# Altium schematic sheet SignalAdapter.SchDoc
size A4; SheetNumber: 2; SheetTotal: 2
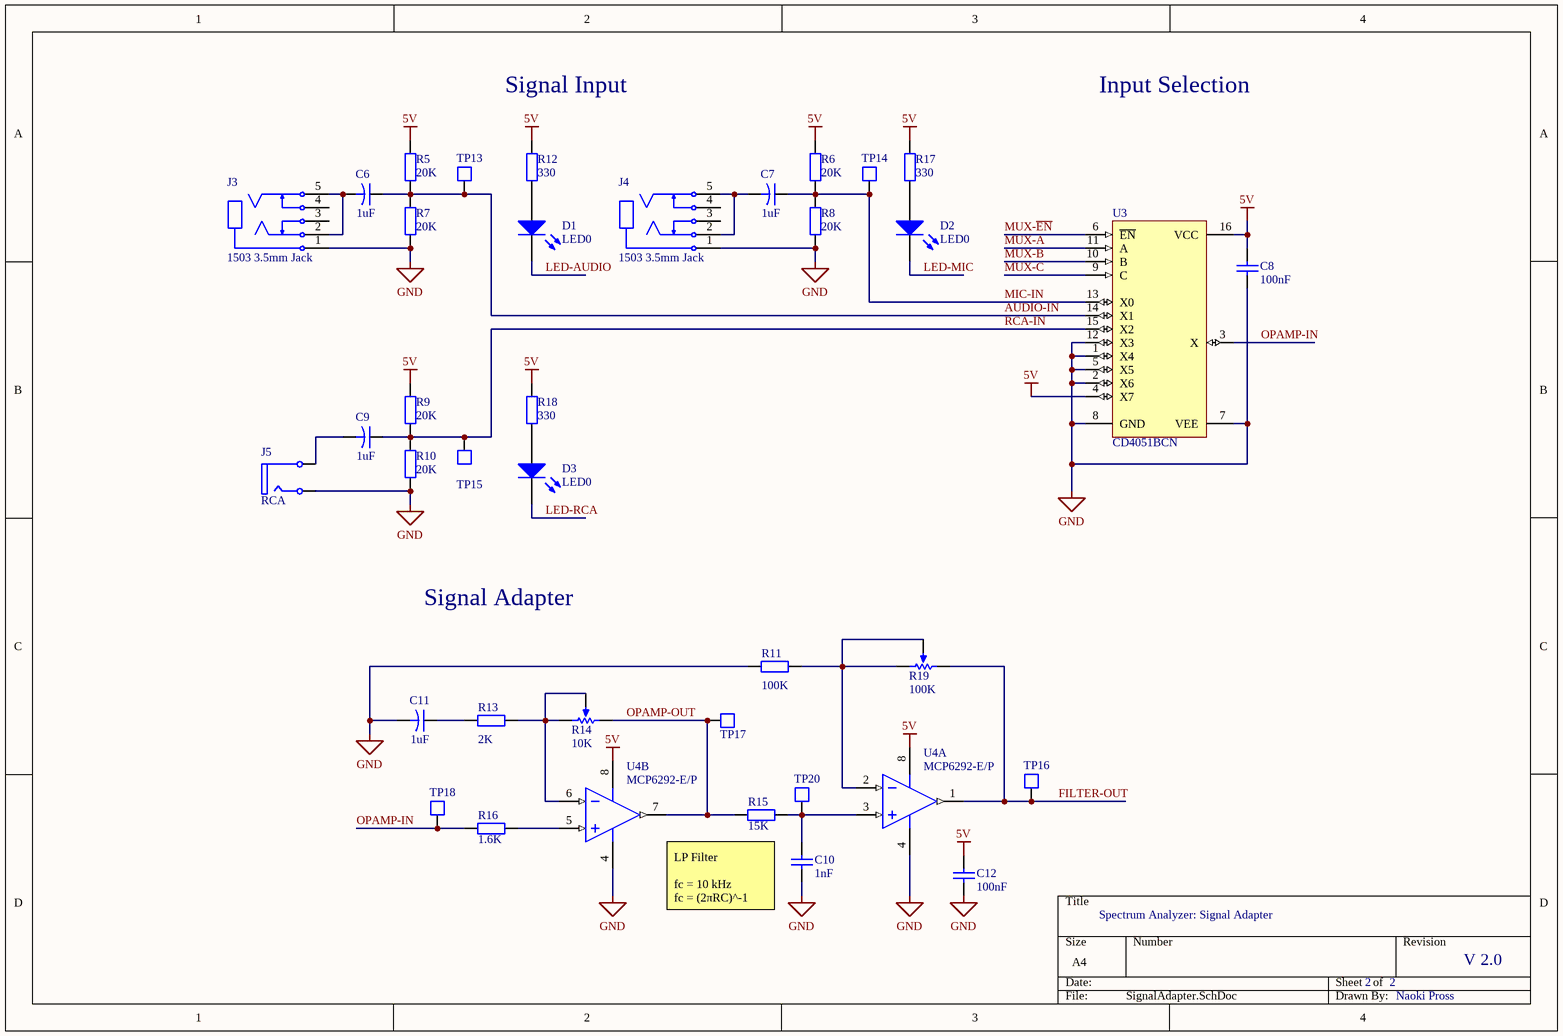
[diagram p0: SignalAdapter.SchDoc]

## Parts
C6  value 1uF  [CAPR5-4X5]  (hidden comment: Cap2)
C7  value 1uF  [CAPR5-4X5]  (hidden comment: Cap2)
C8  value 100nF  [RAD-0.1]  (hidden comment: Cap)
C9  value 1uF  [CAPR5-4X5]  (hidden comment: Cap2)
C10  value 1nF  [RAD-0.1]  (hidden comment: Cap)
C11  value 1uF  [CAPR5-4X5]  (hidden comment: Cap2)
C12  value 100nF  [RAD-0.1]  (hidden comment: Cap)
D1  LED0  [LED-0]
D2  LED0  [LED-0]
D3  LED0  [LED-0]
J3  1503 3.5mm Jack  [JIS C 6560]
J4  1503 3.5mm Jack  [JIS C 6560]
J5  RCA  [RC-5231]
R5  value 20K  [AXIAL-0.4]  (hidden comment: Res2)
R6  value 20K  [AXIAL-0.4]  (hidden comment: Res2)
R7  value 20K  [AXIAL-0.4]  (hidden comment: Res2)
R8  value 20K  [AXIAL-0.4]  (hidden comment: Res2)
R9  value 20K  [AXIAL-0.4]  (hidden comment: Res2)
R10  value 20K  [AXIAL-0.4]  (hidden comment: Res2)
R11  value 100K  [AXIAL-0.4]  (hidden comment: Res2)
R12  value 330  [AXIAL-0.4]  (hidden comment: Res2)
R13  value 2K  [AXIAL-0.4]  (hidden comment: Res2)
R14  value 10K  [VR4]  (hidden comment: RPot)
R15  value 15K  [AXIAL-0.4]  (hidden comment: Res2)
R16  value 1.6K  [AXIAL-0.4]  (hidden comment: Res2)
R17  value 330  [AXIAL-0.4]  (hidden comment: Res2)
R18  value 330  [AXIAL-0.4]  (hidden comment: Res2)
R19  value 100K  [VR4]  (hidden comment: RPot)
TP13  Test Pad  [PIN1]  (value not drawn)
TP14  Test Pad  [PIN1]  (value not drawn)
TP15  Test Pad  [PIN1]  (value not drawn)
TP16  Test Pad  [PIN1]  (value not drawn)
TP17  Test Pad  [PIN1]  (value not drawn)
TP18  Test Pad  [PIN1]  (value not drawn)
TP20  Test Pad  [PIN1]  (value not drawn)
U3  CD4051BCN  [N16E]
U4  MCP6292-E/P  [PDIP300-P8]  (parts A,B of 2)

## Nets
5V: C8.1 C12.1 R5.2 R6.2 R9.2 R12.2 R17.2 R18.2 U3.4(X7) U3.16(VCC) U4.8(VDD)
GND: C8.2 C10.1 C11.2 C12.2 J3.1 J4.1 J5.2B(Signal) R7.1 R8.1 R10.1 R11.1 U3.1(X4) U3.2(X6) U3.5(X5) U3.7(VEE) U3.8(GND) U3.12(X3) U4.4(VSS)
AUDIO-IN: C6.1 R5.1 R7.2 TP13.1 U3.14(X1)
FILTER-OUT: R19.1(TOP) TP16.1 U4.1(VOUTA)
LED-AUDIO: D1.2(K)
LED-MIC: D2.2(K)
LED-RCA: D3.2(K)
MIC-IN: C7.1 R6.1 R8.2 TP14.1 U3.13(X0)
MUX-A: U3.11(A)
MUX-B: U3.10(B)
MUX-C: U3.9(C)
MUX-~{EN}: U3.6(~{EN})
OPAMP-IN: R16.2 TP18.1 U3.3(X)
OPAMP-OUT: R14.1(TOP) R15.2 TP17.1 U4.7(VOUTB)
RCA-IN: C9.1 R9.1 R10.2 TP15.1 U3.15(X2)
NetC6_2: C6.2 J3.2 J3.5
NetC7_2: C7.2 J4.2 J4.5
NetC9_2: C9.2 J5.1A(Ground)
NetC10_2: C10.2 R15.1 TP20.1 U4.3(VINA+)
NetC11_1: C11.1 R13.1
NetD1_1: D1.1(A) R12.1
NetD2_1: D2.1(A) R17.1
NetD3_1: D3.1(A) R18.1
NetR11_2: R11.2 R19.2(BOT) R19.3(TAP) U4.2(VINA-)
NetR13_2: R13.2 R14.2(BOT) R14.3(TAP) U4.6(VINB-)
NetR16_1: R16.1 U4.5(VINB+)

Not connected (* = marked no-connect by the designer): J3 3 4; J4 3 4

## Notes on the sheet
- Signal Input
- Input Selection
- Signal Adapter
- LP Filter
  fc = 10 kHz
  fc = (2πRC)^-1
- Spectrum Analyzer: Signal Adapter
- V 2.0
- Naoki Pross

## Library data of the parts
C6 C7 C9 C11 = Cap2: Capacitor; Published: 23-Sep-2002; PackageReference: CAPR5-4X5; Publisher: Altium Limited; PackageDescription: Capacitor; 2 Leads
C8 C10 C12 = Cap: Capacitor; Published: 8-Jun-2000; LatestRevisionDate: 17-Jul-2002; LatestRevisionNote: Re-released for DXP Platform.; PackageReference: RAD-0.3; Publisher: Altium Limited; PackageDescription: Radial Cap, Thru-Hole; 2 Leads; 0.3 in Pin Spacing
D1-D3 = LED0: Typical INFRARED GaAs LED; Published: 8-Jun-2000; LatestRevisionDate: 08-Jul-2005; LatestRevisionNote: Mech Layer 1 removed.; PackageReference: LED-0; Publisher: Altium Limited; PackageDescription: LED; 2 Leads
J3 J4 = 1503: 1503 09/17 Jack connector
J5 = RCA: RCA Phono Jack, Right Angle, Thru-Hole, Snap-In; pin to pad: 1A>4 2B>1; PCB_Layout: Complies with manufacturer's recommendation.; DrillAndSlotSize: Corresponds to nominal value.; Published: 15-Jul-2004; LatestRevisionDate: 15-Jul-2004; LatestRevisionNote: Component Replaced.; DatasheetDocument: 7-Jul-2000; PackageDocument: 7-Jul-2000; PackageReference: 161; Publisher: Altium Limited; ComponentLink1Description: Manufacturer Link; ComponentLink1URL: http://www.mouser.com/kobiconn/
R5-R13 R15-R18 = Res2: Resistor; Published: 8-Jun-2000; LatestRevisionDate: 17-Jul-2002; LatestRevisionNote: Re-released for DXP Platform.; PackageReference: AXIAL-0.4; Publisher: Altium Limited; PackageDescription: Axial Device, Thru-Hole; 2 Leads; 0.4 in Pin Spacing
R14 R19 = RPot: Potentiometer; Sim Note: Enter the Resistance value and the set point into parameter fields.; Set Position: 0.5; Published: 8-Jun-2000; LatestRevisionDate: 17-Jul-2002; LatestRevisionNote: Re-released for DXP Platform.; PackageReference: VR5; Publisher: Altium Limited; PackageDescription: Variable Resistor, Thru-Hole; 3 Leads
TP13-TP18 TP20 = TestPad
U3 = CD4051BCN: 8-Channel Analog Multiplexer/Demultiplexer; Published: 17-Jul-2002; LatestRevisionDate: 29-May-2009; LatestRevisionNote: Component Body Added.; DatasheetVersion: Jan-1999; PackageVersion: 2000; PackageReference: N16E; Publisher: Altium Limited; PackageDescription: DIP, 16-Pin, Row Spacing 7.62 mm, Pitch 2.54 mm; ComponentLink1Description: Manufacturer Link; ComponentLink1URL: http://www.fairchildsemi.com/; ComponentLink2Description: Datasheet; ComponentLink2URL: http://www.fairchildsemi.com/ds/CD%2FCD4052BC.pdf
U4 = MCP6292-E/P: 1.0 mA, 10 MHz Rail-to-Rail Operational Amplifier, 8-Pin PDIP, Extended Temperature; Published: 29-Jan-2009; DatasheetVersion: revE, Nov-2007; PackageVersion: revBB, Aug-2009; PackageReference: PDIP300-P8; Publisher: Altium Limited; PackageDescription: 8-Lead Plastic Dual In-Line (P) - 300 mil Body [PDIP]; Supplier 1: Digi-Key; Supplier Part Number 1: MCP6292-E/P-ND; Supplier 2: Farnell; Supplier Part Number 2: 1439466; Code_JEDEC: MS-001; ComponentLink1Description: Datasheet; ComponentLink1URL: http://ww1.microchip.com/downloads/en/DeviceDoc/21812e.pdf; ComponentLink2Description: Packaging Specification; ComponentLink2URL: http://www.microchip.com/stellent/groups/techpub_sg/documents/packagingspec/en012702.pdf; ComponentLink3Description: Microchip.com Home; ComponentLink3URL: http://www.microchip.com/